# Altium schematic sheet NanoPLC.SchDoc
size 278 x 217 mm; Origin: Eagle
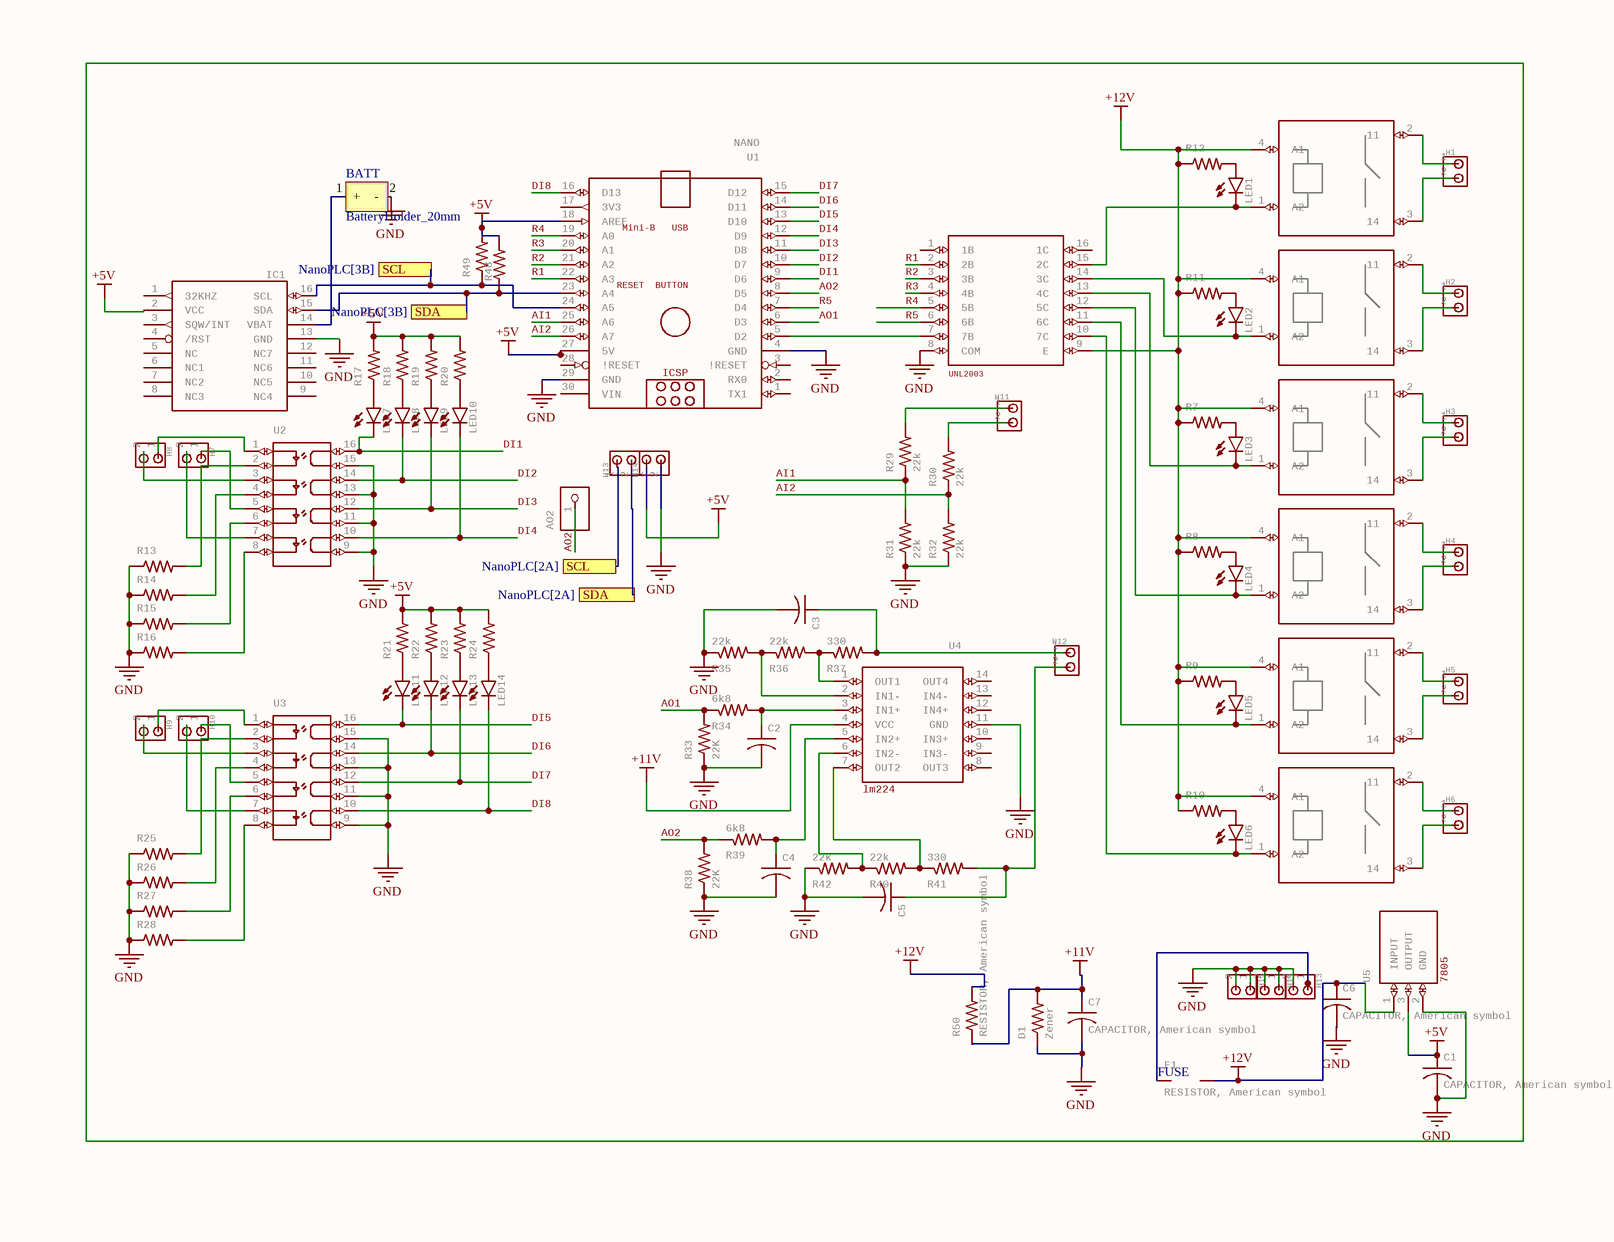
[diagram p0: NanoPLC.SchDoc]

## Parts
(Parts that share a designator on the sheet are numbered #1, #2 ... from top to bottom, then left to right.)
AO2  PINHD-1X1  [1X01]  (value not drawn)
BATT  BatteryHolder_20mm  [BatteryHolderVertical]
C1  CAPACITOR, American symbol  [C025-040X050]
C2  C-USC0805  [C0805]  (value not drawn)
C3  C-USC0805  [C0805]  (value not drawn)
C4  C-USC0805  [C0805]  (value not drawn)
C5  C-USC0805  [C0805]  (value not drawn)
C6  CAPACITOR, American symbol  [C025-040X050]
C7  CAPACITOR, American symbol  [C025-040X050]
D1  Zener  [0204$7]
F1  RESISTOR, American symbol  [20mm_Fuseholder]
H1  TERMBLOCK_5MM_2POS  [TERMBLOCK_5MM_2POS]  (value not drawn)
H2  TERMBLOCK_5MM_2POS  [TERMBLOCK_5MM_2POS]  (value not drawn)
H3  TERMBLOCK_5MM_2POS  [TERMBLOCK_5MM_2POS]  (value not drawn)
H4  TERMBLOCK_5MM_2POS  [TERMBLOCK_5MM_2POS]  (value not drawn)
H5  TERMBLOCK_5MM_2POS  [TERMBLOCK_5MM_2POS]  (value not drawn)
H6  TERMBLOCK_5MM_2POS  [TERMBLOCK_5MM_2POS]  (value not drawn)
H7  TERMBLOCK_5MM_2POS  [TERMBLOCK_5MM_2POS]  (value not drawn)
H8  TERMBLOCK_5MM_2POS  [TERMBLOCK_5MM_2POS]  (value not drawn)
H9  TERMBLOCK_5MM_2POS  [TERMBLOCK_5MM_2POS]  (value not drawn)
H10  TERMBLOCK_5MM_2POS  [TERMBLOCK_5MM_2POS]  (value not drawn)
H11  TERMBLOCK_5MM_2POS  [TERMBLOCK_5MM_2POS]  (value not drawn)
H12  TERMBLOCK_5MM_2POS  [TERMBLOCK_5MM_2POS]  (value not drawn)
H13#1  TERMBLOCK_5MM_2POS  [TERMBLOCK_5MM_2POS]  (value not drawn)
H13#2  TERMBLOCK_5MM_2POS  [TERMBLOCK_5MM_2POS]  (value not drawn)
H14#1  TERMBLOCK_5MM_2POS  [TERMBLOCK_5MM_2POS]  (value not drawn)
H14#2  TERMBLOCK_5MM_2POS  [TERMBLOCK_5MM_2POS]  (value not drawn)
H15  TERMBLOCK_5MM_2POS  [TERMBLOCK_5MM_2POS]  (value not drawn)
IC1  Check availability  [SO16W]  (value not drawn)
LED1  LED3MM  [LED3MM]  (value not drawn)
LED2  LED3MM  [LED3MM]  (value not drawn)
LED3  LED3MM  [LED3MM]  (value not drawn)
LED4  LED3MM  [LED3MM]  (value not drawn)
LED5  LED3MM  [LED3MM]  (value not drawn)
LED6  LED3MM  [LED3MM]  (value not drawn)
LED7  LED3MM  [LED3MM]  (value not drawn)
LED8  LED3MM  [LED3MM]  (value not drawn)
LED9  LED3MM  [LED3MM]  (value not drawn)
LED10  LED3MM  [LED3MM]  (value not drawn)
LED11  LED3MM  [LED3MM]  (value not drawn)
LED12  LED3MM  [LED3MM]  (value not drawn)
LED13  LED3MM  [LED3MM]  (value not drawn)
LED14  LED3MM  [LED3MM]  (value not drawn)
R1  G5NB-1A-E-12VDC  [G5NB-1A-E-12VDC]  (value not drawn)
R2  G5NB-1A-E-12VDC  [G5NB-1A-E-12VDC]  (value not drawn)
R3  G5NB-1A-E-12VDC  [G5NB-1A-E-12VDC]  (value not drawn)
R4  G5NB-1A-E-12VDC  [G5NB-1A-E-12VDC]  (value not drawn)
R5  G5NB-1A-E-12VDC  [G5NB-1A-E-12VDC]  (value not drawn)
R6  G5NB-1A-E-12VDC  [G5NB-1A-E-12VDC]  (value not drawn)
R7  R-US_M1206  [M1206]  (value not drawn)
R8  R-US_M1206  [M1206]  (value not drawn)
R9  R-US_M1206  [M1206]  (value not drawn)
R10  R-US_M1206  [M1206]  (value not drawn)
R11  R-US_M1206  [M1206]  (value not drawn)
R12  R-US_M1206  [M1206]  (value not drawn)
R13  R-US_M1206  [M1206]  (value not drawn)
R14  R-US_M1206  [M1206]  (value not drawn)
R15  R-US_M1206  [M1206]  (value not drawn)
R16  R-US_M1206  [M1206]  (value not drawn)
R17  R-US_M1206  [M1206]  (value not drawn)
R18  R-US_M1206  [M1206]  (value not drawn)
R19  R-US_M1206  [M1206]  (value not drawn)
R20  R-US_M1206  [M1206]  (value not drawn)
R21  R-US_M1206  [M1206]  (value not drawn)
R22  R-US_M1206  [M1206]  (value not drawn)
R23  R-US_M1206  [M1206]  (value not drawn)
R24  R-US_M1206  [M1206]  (value not drawn)
R25  R-US_M1206  [M1206]  (value not drawn)
R26  R-US_M1206  [M1206]  (value not drawn)
R27  R-US_M1206  [M1206]  (value not drawn)
R28  R-US_M1206  [M1206]  (value not drawn)
R29  22k  [M1206]
R30  22k  [M1206]
R31  22k  [M1206]
R32  22k  [M1206]
R33  22K  [M1206]
R34  6k8  [M1206]
R35  22k  [M1206]
R36  22k  [M1206]
R37  330  [M1206]
R38  22K  [M1206]
R39  6k8  [M1206]
R40  22k  [M1206]
R41  330  [M1206]
R42  22k  [M1206]
R48  R-US_M1206  [M1206]  (value not drawn)
R49  R-US_M1206  [M1206]  (value not drawn)
R50  RESISTOR, American symbol  [R2512W]
U1  NANO  Mini-B
USB: Mini-B / USB  RESET
BUTTON: RESET / BUTTON  [NANO]
U2  LTV-847  [SM-16]  (value not drawn)
U3  LTV-847  [SM-16]  (value not drawn)
U4  LM224  [SOIC-14_4MM]
U5  L7805CV  [TO-220]  (value not drawn)
U$2  ULN2003  [SOIC-16]  (value not drawn)

## Ports
SCL (see NanoPLC[2A]), SCL (see NanoPLC[3B]), SDA (see NanoPLC[2A]), SDA (see NanoPLC[3B])

## Nets
+5V: C1.1 H14#1.1 IC1.2(VCC) R17.2 R18.2 R19.2 R20.2 R21.2 R22.2 R23.2 R24.2 R48.2 R49.2 U1.18(AREF) U1.27(5V) U5.3(OUTPUT)
+11V: C7.1 D1.2 R50.1 U4.4(VCC)
+12V: C6.1 F1.2 R1.4(A1) R2.4(A1) R3.4(A1) R4.4(A1) R5.4(A1) R6.4(A1) R7.1 R8.1 R9.1 R10.1 R11.1 R12.1 R50.2 U5.1(INPUT) U$2.9(E)
GND: BATT.2(-) C1.2 C2.2 C3.2 C4.2 C5.2 C6.2 C7.2 D1.1 H13#2.2 H14#1.2 H14#2.1 H14#2.2 H15.1 H15.2 IC1.13(GND) R13.1 R14.1 R15.1 R16.1 R25.1 R26.1 R27.1 R28.1 R31.1 R32.1 R33.1 R35.1 R38.1 R42.1 U1.4(GND) U1.29(GND) U2.9(P$9) U2.11(P$11) U2.13(P$13) U2.15(P$15) U3.9(P$9) U3.11(P$11) U3.13(P$13) U3.15(P$15) U4.11(GND) U5.2(GND) U$2.8(COM)
AI1: R29.1 R31.2 U1.25(A6)
AI2: R30.1 R32.2 U1.26(A7)
AO1: R33.2 R34.1 U1.6(D3)
AO2: AO2.1 R38.2 R39.1 U1.8(D5)
DI1: LED7.K(C) U1.9(D6) U2.16(P$16)
DI2: LED8.K(C) U1.10(D7) U2.14(P$14)
DI3: LED9.K(C) U1.11(D8) U2.12(P$12)
DI4: LED10.K(C) U1.12(D9) U2.10(P$10)
DI5: LED11.K(C) U1.13(D10) U3.16(P$16)
DI6: LED12.K(C) U1.14(D11) U3.14(P$14)
DI7: LED13.K(C) U1.15(D12) U3.12(P$12)
DI8: LED14.K(C) U1.16(D13) U3.10(P$10)
R1: U1.22(A3) U$2.2(2B)
R2: U1.21(A2) U$2.3(3B)
R3: U1.20(A1) U$2.4(4B)
R4: U1.19(A0) U$2.5(5B)
R5: U1.7(D4) U$2.6(6B)
SCL: H13#1.1 IC1.16(SCL) R49.1 U1.24(A5) ; port SCL
SDA: H13#1.2 IC1.15(SDA) R48.1 U1.23(A4) ; port SDA
NetBATT_1: BATT.1(+) IC1.14(VBAT)
NetC2_1: C2.1 R34.2 U4.3(IN1+)
NetC3_1: C3.1 H12.1 R37.2
NetC4_1: C4.1 R39.2 U4.5(IN2+)
NetC5_1: C5.1 H12.2 R41.2
NetF1_1: F1.1 H13#2.1
NetH1_1: H1.1 R1.2(11)
NetH1_2: H1.2 R1.3(14)
NetH2_1: H2.1 R2.2(11)
NetH2_2: H2.2 R2.3(14)
NetH3_1: H3.1 R3.2(11)
NetH3_2: H3.2 R3.3(14)
NetH4_1: H4.1 R4.2(11)
NetH4_2: H4.2 R4.3(14)
NetH5_1: H5.1 R5.2(11)
NetH5_2: H5.2 R5.3(14)
NetH6_1: H6.1 R6.2(11)
NetH6_2: H6.2 R6.3(14)
NetH7_1: H7.1 U2.5(P$5)
NetH7_2: H7.2 U2.7(P$7)
NetH8_1: H8.1 U2.1(P$1)
NetH8_2: H8.2 U2.3(P$3)
NetH9_1: H9.1 U3.1(P$1)
NetH9_2: H9.2 U3.3(P$3)
NetH10_1: H10.1 U3.5(P$5)
NetH10_2: H10.2 U3.7(P$7)
NetH11_1: H11.1 R29.2
NetH11_2: H11.2 R30.2
NetLED1_A: LED1.A R12.2
NetLED1_K: LED1.K(C) R1.1(A2) U$2.15(2C)
NetLED2_A: LED2.A R11.2
NetLED2_K: LED2.K(C) R2.1(A2) U$2.14(3C)
NetLED3_A: LED3.A R7.2
NetLED3_K: LED3.K(C) R3.1(A2) U$2.13(4C)
NetLED4_A: LED4.A R8.2
NetLED4_K: LED4.K(C) R4.1(A2) U$2.12(5C)
NetLED5_A: LED5.A R9.2
NetLED5_K: LED5.K(C) R5.1(A2) U$2.11(6C)
NetLED6_A: LED6.A R10.2
NetLED6_K: LED6.K(C) R6.1(A2) U$2.10(7C)
NetLED7_A: LED7.A R17.1
NetLED8_A: LED8.A R18.1
NetLED9_A: LED9.A R19.1
NetLED10_A: LED10.A R20.1
NetLED11_A: LED11.A R21.1
NetLED12_A: LED12.A R22.1
NetLED13_A: LED13.A R23.1
NetLED14_A: LED14.A R24.1
NetR13_2: R13.2 U2.2(P$2)
NetR14_2: R14.2 U2.4(P$4)
NetR15_2: R15.2 U2.6(P$6)
NetR16_2: R16.2 U2.8(P$8)
NetR25_2: R25.2 U3.2(P$2)
NetR26_2: R26.2 U3.4(P$4)
NetR27_2: R27.2 U3.6(P$6)
NetR28_2: R28.2 U3.8(P$8)
NetR35_2: R35.2 R36.1 U4.2(IN1-)
NetR36_2: R36.2 R37.1 U4.1(OUT1)
NetR40_1: R40.1 R42.2 U4.6(IN2-)
NetR40_2: R40.2 R41.1 U4.7(OUT2)
NetU1_5: U1.5(D2) U$2.7(7B)

Not connected (* = marked no-connect by the designer): IC1 1(32KHZ) 3(SQW/INT) 4(/RST) 5(NC) 6(NC1) 7(NC2) 8(NC3) 9(NC4) 10(NC5) 11(NC6) 12(NC7); U1 1(TX1) 2(RX0) 3(!RESET) 17(3V3) 28(!RESET) 30(VIN); U4 8(OUT3) 9(IN3-) 10(IN3+) 12(IN4+) 13(IN4-) 14(OUT4); U$2 1(1B) 16(1C)

## Notes on the sheet
- (in symbol R-US_M5923_1) FUSE

## Library data of the parts
AO2 = PINHD-1X1: PIN HEADER; GateName_1: G$1; SymbolName_1: PINHD1; POPULARITY: 64; LibraryName: pinhead; DeviceSetName: PINHD-1X1
C1 C6 C7 = C-US025-040X050: GateName_1: G$1; SymbolName_1: C-US; DeviceName: 025-040X050; LibraryName: DR; DeviceSetName: C-US; Package: C025-040X050
C2-C5 = C-USC0805: CAPACITOR, American symbol; GateName_1: G$1; SymbolName_1: C-US; DeviceName: C0805; LibraryName: DR; DeviceSetName: C-US
D1 = R-US_0207/7: GateName_1: G$1; SymbolName_1: R-US; DeviceName: 0207/7; DeviceSetName: R-US_; LibraryName: DR; Package: 0207/7
F1 = R-US_M5923_1: GateName_1: G$1; SymbolName_1: R-US; DeviceName: M5923; DeviceSetName: R-US_; LibraryName: DR; Package: M5923
H1-H12 H13#1 H13#2 H14#1 H14#2 H15 = TERMBLOCK_5MM_2POS: GateName_1: G$1; SymbolName_1: PINHEAD-2; LibraryName: DR; DeviceSetName: TERMBLOCK_5MM_2POS
IC1 = DS3231/SO: GateName_1: G$1; SymbolName_1: DS3231; DeviceName: /SO; MF: Analog Devices; LibraryName: DR; DeviceSetName: DS3231; PACKAGE: SOIC-16 Maxim Integrated; AVAILABILITY: In Stock; CHECK_PRICES: https://www.snapeda.com/parts/DS3231/Analog+Devices/view-part/?ref=eda; MP: DS3231; PRICE: None; SNAPEDA_LINK: https://www.snapeda.com/parts/DS3231/Analog+Devices/view-part/?ref=snap
LED1-LED14 = LED3MM: LED   OSRAM: - CHIPLED LG R971, LG N971, LY N971, LG Q971, LY Q971, LO R971, LY R971 LH N974, LH R974 LS Q976, LO Q976, LY Q976 LO Q996 - Hyper CHIPLED LW Q18S LB Q993, LB Q99A, LB R99A - SideLED LS A670, LO A670, LY A670, LG A670, LP A670 LB A673, LV A673, LT A673, LW A673 LH A674 LY A675 LS A676, LA A676, LO A676, LY A676, LW A676 LS A679, LY A679, LG A679 -  Hyper Micro SIDELEDÂ® LS Y876, LA Y876, LO Y876, LY Y876 LT Y87S - SmartLED LW L88C, LW L88S LB L89C, LB L89S, LG L890 LS L89K, LO L89K, LY L89K LS L896, LA L896, LO L896, LY L896 - TOPLED LS T670, LO T670, LY T670, LG T670, LP T670 LSG T670, LSP T670, LSY T670, LOP T670, LYG T670 LG T671, LOG T671, LSG T671 LB T673, LV T673, LT T673, LW T673 LH T674 LS T676, LA T676, LO T676, LY T676, LB T676, LH T676, LSB T676, LW T676 LB T67C, LV T67C, LT T67C, LS T67K, LO T67K, LY T67K, LW E67C LS E67B, LA E67B, LO E67B, LY E67B, LB E67C, LV E67C, LT E67C LW T67C LS T679, LY T679, LG T679 LS T770, LO T770, LY T770, LG T770, LP T770 LB T773, LV T773, LT T773, LW T773 LH T774 LS E675, LA E675, LY E675, LS T675 LS T776, LA T776, LO T776, LY T776, LB T776 LHGB T686 LT T68C, LB T68C - Hyper Mini TOPLEDÂ® LB M676 - Mini TOPLED SantanaÂ® LG M470 LS M47K, LO M47K, LY M47K    Source: http://www.osram.convergy.de   LUXEON: - LUMILEDÂ® LXK2-PW12-R00, LXK2-PW12-S00, LXK2-PW14-U00, LXK2-PW14-V00 LXK2-PM12-R00, LXK2-PM12-S00, LXK2-PM14-U00 LXK2-PE12-Q00, LXK2-PE12-R00, LXK2-PE12-S00, LXK2-PE14-T00, LXK2-PE14-U00 LXK2-PB12-K00, LXK2-PB12-L00, LXK2-PB12-M00, LXK2-PB14-N00, LXK2-PB14-P00, LXK2-PB14-Q00 LXK2-PR12-L00, LXK2-PR12-M00, LXK2-PR14-Q00, LXK2-PR14-R00 LXK2-PD12-Q00, LXK2-PD12-R00, LXK2-PD12-S00 LXK2-PH12-R00, LXK2-PH12-S00 LXK2-PL12-P00, LXK2-PL12-Q00, LXK2-PL12-R00    Source: www.luxeon.com   KINGBRIGHT:   KA-3528ASYC Source: www.kingbright.com; GateName_1: G$1; DeviceName: 3MM; POPULARITY: 97; SymbolName_1: LED; LibraryName: led; DeviceSetName: LED
R1-R6 = G5NB-1A-E-12VDC: GateName_1: G$1; SymbolName_1: RELAY_SPST; LibraryName: DR; DeviceSetName: G5NB-1A-E-12VDC
R7-R42 R48 R49 = R-US_M1206: RESISTOR, American symbol; GateName_1: G$1; SymbolName_1: R-US; DeviceSetName: R-US_; DeviceName: M1206; LibraryName: DR
R50 = R-US_R2512W: GateName_1: G$1; SymbolName_1: R-US; DeviceSetName: R-US_; DeviceName: R2512W; LibraryName: DR; Package: R2512W
U1 = NANO: GateName_1: G$1; SymbolName_1: NANO; LibraryName: DR; DeviceSetName: NANO; ICSP: ICSP
U2 U3 = LTV-847: OptoIsolator; GateName_1: G$1; SymbolName_1: LTV-847; LibraryName: DR; DeviceSetName: LTV-847
U4 = LM224: LM224 Op Amp; GateName_1: G$1; SymbolName_1: LM224; LibraryName: DR; DeviceSetName: LM224; lm224: lm224
U5 = L7805CV: GateName_1: G$1; SymbolName_1: 7805; LibraryName: DR; DeviceSetName: L7805CV; 7805: 7805
U$2 = ULN2003: GateName_1: G$1; SymbolName_1: UNL2003; LibraryName: DR; DeviceSetName: ULN2003; UNL2003: UNL2003